# Altium schematic sheet 12_DDR2.SchDoc: DDR2
size A3; Organization: Lime Microsystems; Address1: Surrey Tech Centre; Address2: Guildford GU2 7YG; Address3: Surrey; Address4: United Kingdom; Revision: v1.3; SheetNumber: 12; SheetTotal: 16
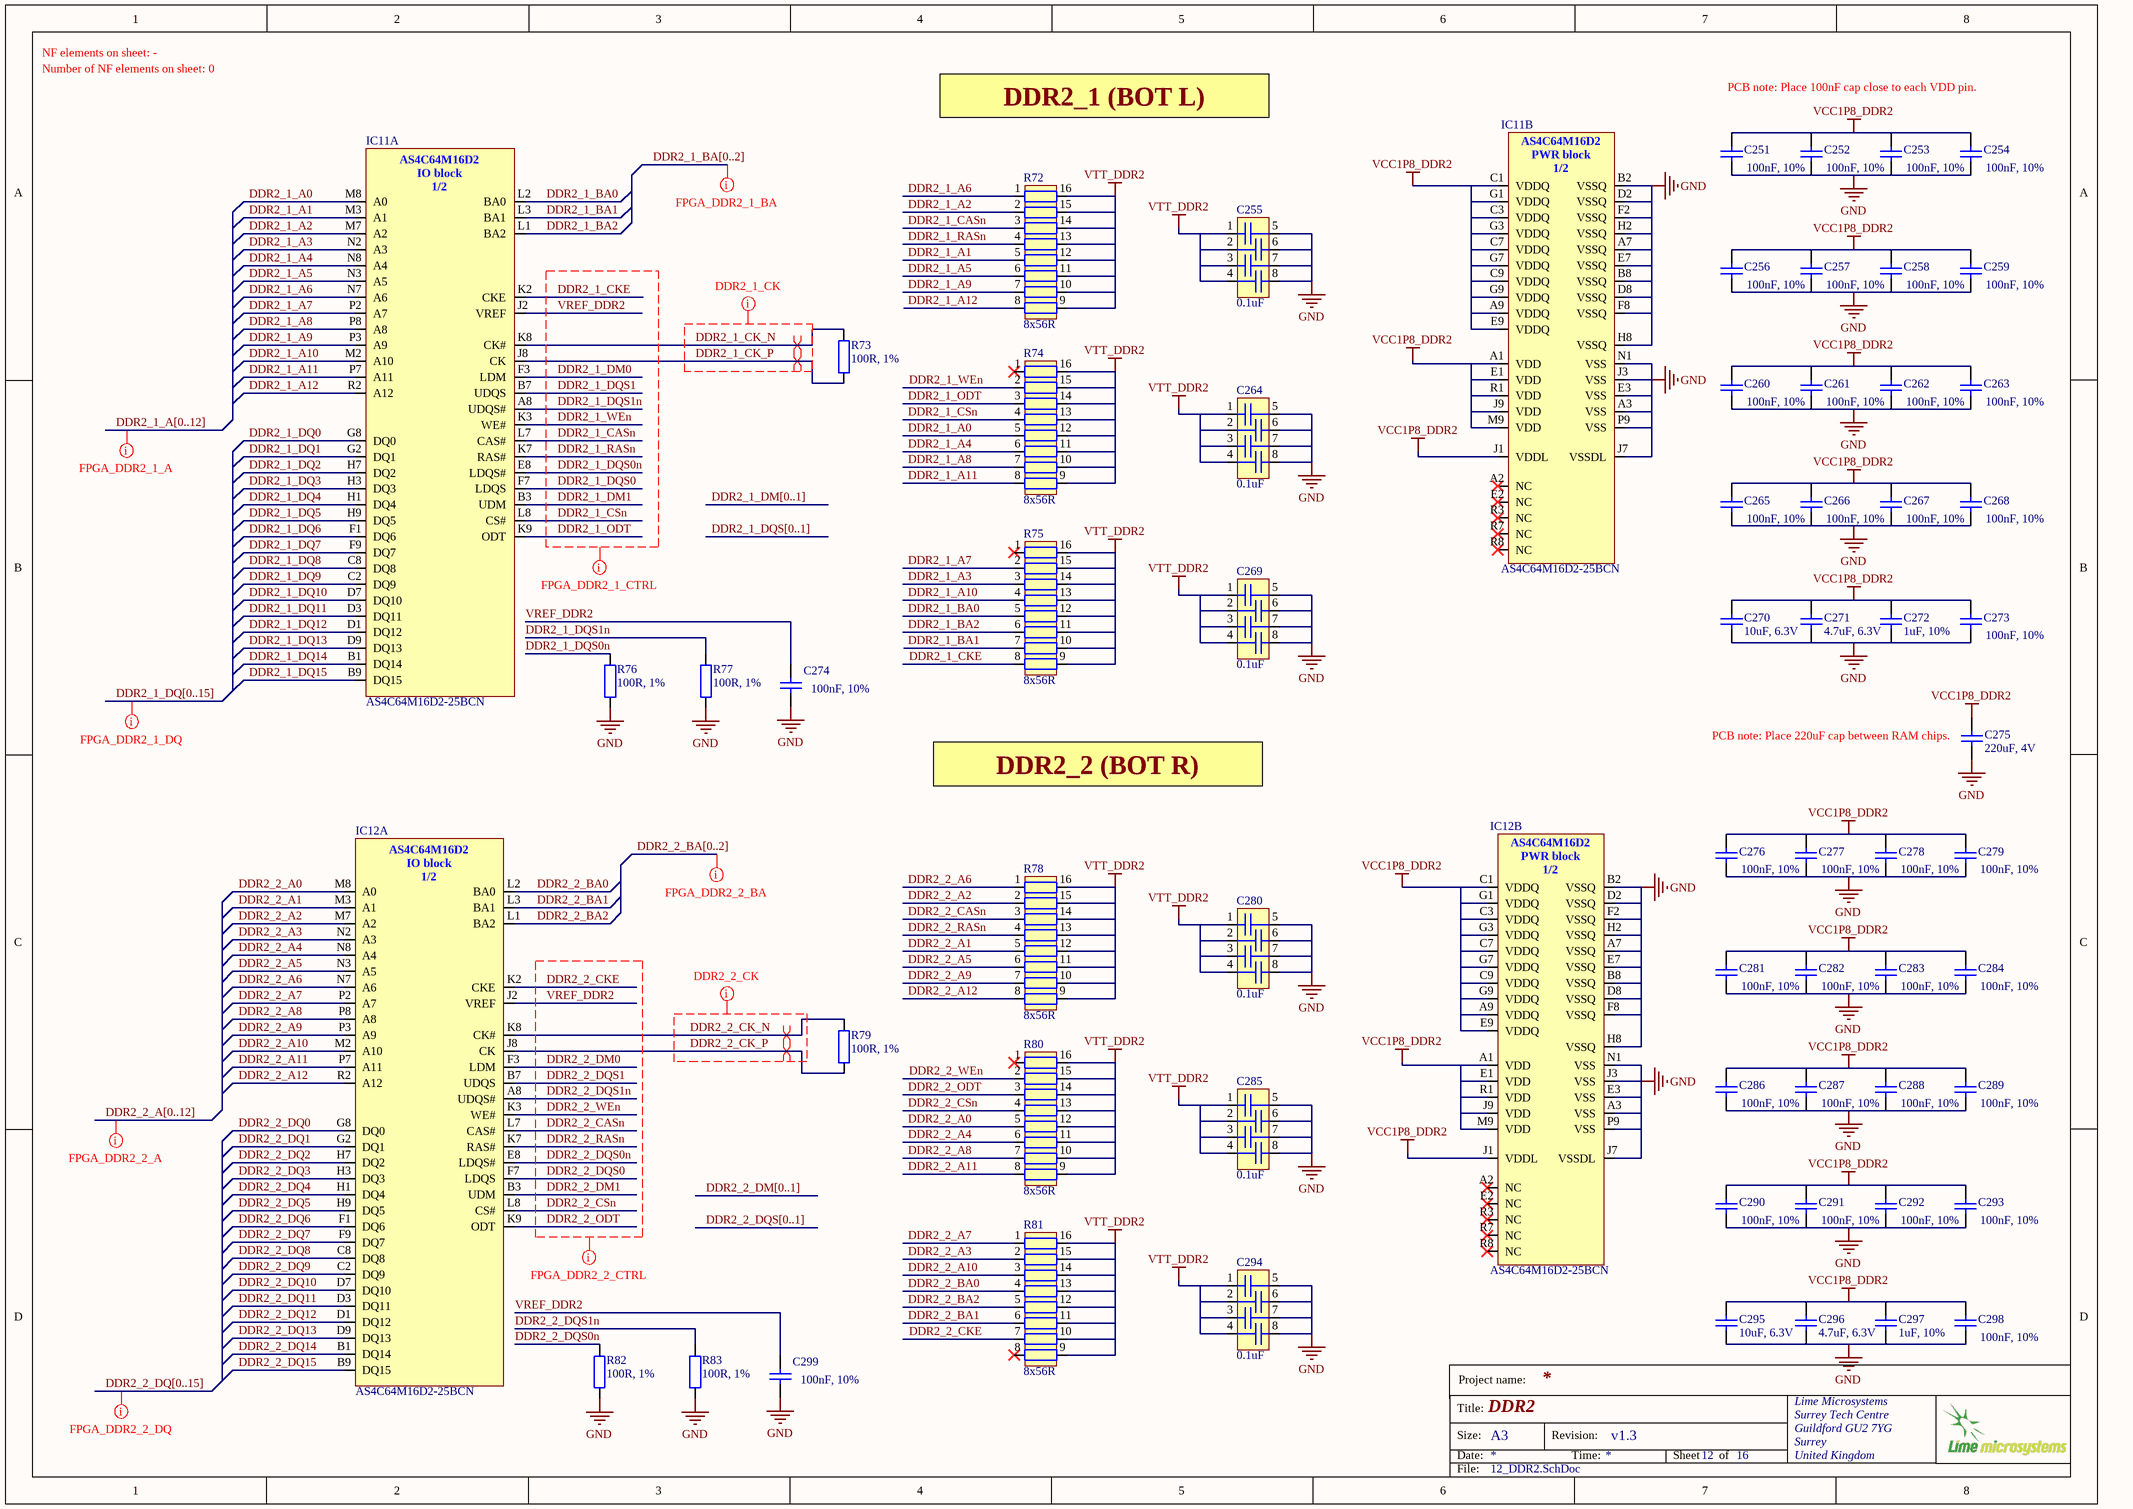
[diagram p0: 12_DDR2.SchDoc]

## Parts
C251  100nF, 10%  [CAP0402]
C252  100nF, 10%  [CAP0402]
C253  100nF, 10%  [CAP0402]
C254  100nF, 10%  [CAP0402]
C255  0.1uF  [CKCA43X7R1C104M100AA]
C256  100nF, 10%  [CAP0402]
C257  100nF, 10%  [CAP0402]
C258  100nF, 10%  [CAP0402]
C259  100nF, 10%  [CAP0402]
C260  100nF, 10%  [CAP0402]
C261  100nF, 10%  [CAP0402]
C262  100nF, 10%  [CAP0402]
C263  100nF, 10%  [CAP0402]
C264  0.1uF  [CKCA43X7R1C104M100AA]
C265  100nF, 10%  [CAP0402]
C266  100nF, 10%  [CAP0402]
C267  100nF, 10%  [CAP0402]
C268  100nF, 10%  [CAP0402]
C269  0.1uF  [CKCA43X7R1C104M100AA]
C270  10uF, 6.3V  [CAP0603]
C271  4.7uF, 6.3V  [CAP0402]
C272  1uF, 10%  [CAP0402]
C273  100nF, 10%  [CAP0402]
C274  100nF, 10%  [CAP0402]
C275  220uF, 4V  [CAP1206]
C276  100nF, 10%  [CAP0402]
C277  100nF, 10%  [CAP0402]
C278  100nF, 10%  [CAP0402]
C279  100nF, 10%  [CAP0402]
C280  0.1uF  [CKCA43X7R1C104M100AA]
C281  100nF, 10%  [CAP0402]
C282  100nF, 10%  [CAP0402]
C283  100nF, 10%  [CAP0402]
C284  100nF, 10%  [CAP0402]
C285  0.1uF  [CKCA43X7R1C104M100AA]
C286  100nF, 10%  [CAP0402]
C287  100nF, 10%  [CAP0402]
C288  100nF, 10%  [CAP0402]
C289  100nF, 10%  [CAP0402]
C290  100nF, 10%  [CAP0402]
C291  100nF, 10%  [CAP0402]
C292  100nF, 10%  [CAP0402]
C293  100nF, 10%  [CAP0402]
C294  0.1uF  [CKCA43X7R1C104M100AA]
C295  10uF, 6.3V  [CAP0603]
C296  4.7uF, 6.3V  [CAP0402]
C297  1uF, 10%  [CAP0402]
C298  100nF, 10%  [CAP0402]
C299  100nF, 10%  [CAP0402]
IC11  AS4C64M16D2-25BCN  [AS4C64M16D2]  (parts A,B of 2)
IC12  AS4C64M16D2-25BCN  [AS4C64M16D2]  (parts A,B of 2)
R72  8x56R  [EXB2HV]
R73  100R, 1%  [RES0402]
R74  8x56R  [EXB2HV]
R75  8x56R  [EXB2HV]
R76  100R, 1%  [RES0402]
R77  100R, 1%  [RES0402]
R78  8x56R  [EXB2HV]
R79  100R, 1%  [RES0402]
R80  8x56R  [EXB2HV]
R81  8x56R  [EXB2HV]
R82  100R, 1%  [RES0402]
R83  100R, 1%  [RES0402]

## Nets
GND: C251.2 C252.2 C253.2 C254.2 C255.5 C255.6 C255.7 C255.8 C256.2 C257.2 C258.2 C259.2 C260.2 C261.2 C262.2 C263.2 C264.5 C264.6 C264.7 C264.8 C265.2 C266.2 C267.2 C268.2 C269.5 C269.6 C269.7 C269.8 C270.1 C271.1 C272.1 C273.2 C274.2 C275.1 C276.2 C277.2 C278.2 C279.2 C280.5 C280.6 C280.7 C280.8 C281.2 C282.2 C283.2 C284.2 C285.5 C285.6 C285.7 C285.8 C286.2 C287.2 C288.2 C289.2 C290.2 C291.2 C292.2 C293.2 C294.5 C294.6 C294.7 C294.8 C295.1 C296.1 C297.1 C298.2 C299.2 IC11.A3(VSS) IC11.A7(VSSQ) IC11.B2(VSSQ) IC11.B8(VSSQ) IC11.D2(VSSQ) IC11.D8(VSSQ) IC11.E3(VSS) IC11.E7(VSSQ) IC11.F2(VSSQ) IC11.F8(VSSQ) IC11.H2(VSSQ) IC11.H8(VSSQ) IC11.J3(VSS) IC11.J7(VSSDL) IC11.N1(VSS) IC11.P9(VSS) IC12.A3(VSS) IC12.A7(VSSQ) IC12.B2(VSSQ) IC12.B8(VSSQ) IC12.D2(VSSQ) IC12.D8(VSSQ) IC12.E3(VSS) IC12.E7(VSSQ) IC12.F2(VSSQ) IC12.F8(VSSQ) IC12.H2(VSSQ) IC12.H8(VSSQ) IC12.J3(VSS) IC12.J7(VSSDL) IC12.N1(VSS) IC12.P9(VSS) R76.1 R77.1 R82.1 R83.1
VCC1P8_DDR2: C251.1 C252.1 C253.1 C254.1 C256.1 C257.1 C258.1 C259.1 C260.1 C261.1 C262.1 C263.1 C265.1 C266.1 C267.1 C268.1 C270.2 C271.2 C272.2 C273.1 C275.2 C276.1 C277.1 C278.1 C279.1 C281.1 C282.1 C283.1 C284.1 C286.1 C287.1 C288.1 C289.1 C290.1 C291.1 C292.1 C293.1 C295.2 C296.2 C297.2 C298.1 IC11.A1(VDD) IC11.A9(VDDQ) IC11.C1(VDDQ) IC11.C3(VDDQ) IC11.C7(VDDQ) IC11.C9(VDDQ) IC11.E1(VDD) IC11.E9(VDDQ) IC11.G1(VDDQ) IC11.G3(VDDQ) IC11.G7(VDDQ) IC11.G9(VDDQ) IC11.J1(VDDL) IC11.J9(VDD) IC11.M9(VDD) IC11.R1(VDD) IC12.A1(VDD) IC12.A9(VDDQ) IC12.C1(VDDQ) IC12.C3(VDDQ) IC12.C7(VDDQ) IC12.C9(VDDQ) IC12.E1(VDD) IC12.E9(VDDQ) IC12.G1(VDDQ) IC12.G3(VDDQ) IC12.G7(VDDQ) IC12.G9(VDDQ) IC12.J1(VDDL) IC12.J9(VDD) IC12.M9(VDD) IC12.R1(VDD)
VTT_DDR2: C255.1 C255.2 C255.3 C255.4 C264.1 C264.2 C264.3 C264.4 C269.1 C269.2 C269.3 C269.4 C280.1 C280.2 C280.3 C280.4 C285.1 C285.2 C285.3 C285.4 C294.1 C294.2 C294.3 C294.4 R72.9 R72.10 R72.11 R72.12 R72.13 R72.14 R72.15 R72.16 R74.9 R74.10 R74.11 R74.12 R74.13 R74.14 R74.15 R74.16 R75.9 R75.10 R75.11 R75.12 R75.13 R75.14 R75.15 R75.16 R78.9 R78.10 R78.11 R78.12 R78.13 R78.14 R78.15 R78.16 R80.9 R80.10 R80.11 R80.12 R80.13 R80.14 R80.15 R80.16 R81.9 R81.10 R81.11 R81.12 R81.13 R81.14 R81.15 R81.16
DDR2_1_A0: IC11.M8(A0) R74.5
DDR2_1_A1: IC11.M3(A1) R72.5
DDR2_1_A2: IC11.M7(A2) R72.2
DDR2_1_A3: IC11.N2(A3) R75.3
DDR2_1_A4: IC11.N8(A4) R74.6
DDR2_1_A5: IC11.N3(A5) R72.6
DDR2_1_A6: IC11.N7(A6) R72.1
DDR2_1_A7: IC11.P2(A7) R75.2
DDR2_1_A8: IC11.P8(A8) R74.7
DDR2_1_A9: IC11.P3(A9) R72.7
DDR2_1_A10: IC11.M2(A10) R75.4
DDR2_1_A11: IC11.P7(A11) R74.8
DDR2_1_A12: IC11.R2(A12) R72.8
DDR2_1_BA0: IC11.L2(BA0) R75.5
DDR2_1_BA1: IC11.L3(BA1) R75.7
DDR2_1_BA2: IC11.L1(BA2) R75.6
DDR2_1_CASn: IC11.L7(CAS#) R72.3
DDR2_1_CK_N: IC11.K8(CK#) R73.2
DDR2_1_CK_P: IC11.J8(CK) R73.1
DDR2_1_CKE: IC11.K2(CKE) R75.8
DDR2_1_CSn: IC11.L8(CS#) R74.4
DDR2_1_DM0: IC11.F3(LDM)
DDR2_1_DM1: IC11.B3(UDM)
DDR2_1_DQ0: IC11.G8(DQ0)
DDR2_1_DQ1: IC11.G2(DQ1)
DDR2_1_DQ2: IC11.H7(DQ2)
DDR2_1_DQ3: IC11.H3(DQ3)
DDR2_1_DQ4: IC11.H1(DQ4)
DDR2_1_DQ5: IC11.H9(DQ5)
DDR2_1_DQ6: IC11.F1(DQ6)
DDR2_1_DQ7: IC11.F9(DQ7)
DDR2_1_DQ8: IC11.C8(DQ8)
DDR2_1_DQ9: IC11.C2(DQ9)
DDR2_1_DQ10: IC11.D7(DQ10)
DDR2_1_DQ11: IC11.D3(DQ11)
DDR2_1_DQ12: IC11.D1(DQ12)
DDR2_1_DQ13: IC11.D9(DQ13)
DDR2_1_DQ14: IC11.B1(DQ14)
DDR2_1_DQ15: IC11.B9(DQ15)
DDR2_1_DQS0: IC11.F7(LDQS)
DDR2_1_DQS0n: IC11.E8(LDQS#) R76.2
DDR2_1_DQS1: IC11.B7(UDQS)
DDR2_1_DQS1n: IC11.A8(UDQS#) R77.2
DDR2_1_ODT: IC11.K9(ODT) R74.3
DDR2_1_RASn: IC11.K7(RAS#) R72.4
DDR2_1_WEn: IC11.K3(WE#) R74.2
DDR2_2_A0: IC12.M8(A0) R80.5
DDR2_2_A1: IC12.M3(A1) R78.5
DDR2_2_A2: IC12.M7(A2) R78.2
DDR2_2_A3: IC12.N2(A3) R81.2
DDR2_2_A4: IC12.N8(A4) R80.6
DDR2_2_A5: IC12.N3(A5) R78.6
DDR2_2_A6: IC12.N7(A6) R78.1
DDR2_2_A7: IC12.P2(A7) R81.1
DDR2_2_A8: IC12.P8(A8) R80.7
DDR2_2_A9: IC12.P3(A9) R78.7
DDR2_2_A10: IC12.M2(A10) R81.3
DDR2_2_A11: IC12.P7(A11) R80.8
DDR2_2_A12: IC12.R2(A12) R78.8
DDR2_2_BA0: IC12.L2(BA0) R81.4
DDR2_2_BA1: IC12.L3(BA1) R81.6
DDR2_2_BA2: IC12.L1(BA2) R81.5
DDR2_2_CASn: IC12.L7(CAS#) R78.3
DDR2_2_CK_N: IC12.K8(CK#) R79.2
DDR2_2_CK_P: IC12.J8(CK) R79.1
DDR2_2_CKE: IC12.K2(CKE) R81.7
DDR2_2_CSn: IC12.L8(CS#) R80.4
DDR2_2_DM0: IC12.F3(LDM)
DDR2_2_DM1: IC12.B3(UDM)
DDR2_2_DQ0: IC12.G8(DQ0)
DDR2_2_DQ1: IC12.G2(DQ1)
DDR2_2_DQ2: IC12.H7(DQ2)
DDR2_2_DQ3: IC12.H3(DQ3)
DDR2_2_DQ4: IC12.H1(DQ4)
DDR2_2_DQ5: IC12.H9(DQ5)
DDR2_2_DQ6: IC12.F1(DQ6)
DDR2_2_DQ7: IC12.F9(DQ7)
DDR2_2_DQ8: IC12.C8(DQ8)
DDR2_2_DQ9: IC12.C2(DQ9)
DDR2_2_DQ10: IC12.D7(DQ10)
DDR2_2_DQ11: IC12.D3(DQ11)
DDR2_2_DQ12: IC12.D1(DQ12)
DDR2_2_DQ13: IC12.D9(DQ13)
DDR2_2_DQ14: IC12.B1(DQ14)
DDR2_2_DQ15: IC12.B9(DQ15)
DDR2_2_DQS0: IC12.F7(LDQS)
DDR2_2_DQS0n: IC12.E8(LDQS#) R82.2
DDR2_2_DQS1: IC12.B7(UDQS)
DDR2_2_DQS1n: IC12.A8(UDQS#) R83.2
DDR2_2_ODT: IC12.K9(ODT) R80.3
DDR2_2_RASn: IC12.K7(RAS#) R78.4
DDR2_2_WEn: IC12.K3(WE#) R80.2
VREF_DDR2: C274.1 C299.1 IC11.J2(VREF) IC12.J2(VREF)

Not connected (* = marked no-connect by the designer): IC11 A2(NC)* E2(NC)* R3(NC)* R7(NC)* R8(NC)*; IC12 A2(NC)* E2(NC)* R3(NC)* R7(NC)* R8(NC)*; R74 1*; R75 1*; R80 1*; R81 8*

## Buses and harness runs
bus DDR2_1_A[0..12]
bus DDR2_1_BA[0..2]
bus DDR2_1_DM[0..1]
bus DDR2_1_DQ[0..15]
bus DDR2_1_DQS[0..1]
bus DDR2_2_A[0..12]
bus DDR2_2_BA[0..2]
bus DDR2_2_DM[0..1]
bus DDR2_2_DQ[0..15]
bus DDR2_2_DQS[0..1]

## Layout directives
net class FPGA_DDR0_DQ: (no net found under the mark)
net class FPGA_DDR0_BA: (no net found under the mark)
net class FPGA_DDR0_CTRL: DDR2_1_CASn, DDR2_1_CKE, DDR2_1_CSn, DDR2_1_DM0, DDR2_1_DM1, DDR2_1_DQS0, DDR2_1_DQS0n, DDR2_1_DQS1, DDR2_1_DQS1n, DDR2_1_ODT, DDR2_1_RASn, DDR2_1_WEn, VREF_DDR2
net class FPGA_DDR0_A: (no net found under the mark)
net class FPGA_DDR1_DQ: (no net found under the mark)
net class FPGA_DDR1_BA: (no net found under the mark)
net class FPGA_DDR1_CTRL: DDR2_2_CASn, DDR2_2_CKE, DDR2_2_CSn, DDR2_2_DM0, DDR2_2_DM1, DDR2_2_DQS0, DDR2_2_DQS0n, DDR2_2_DQS1, DDR2_2_DQS1n, DDR2_2_ODT, DDR2_2_RASn, DDR2_2_WEn, VREF_DDR2
net class FPGA_DDR1_A: (no net found under the mark)
differential pair: DDR2_1_CK_N, DDR2_1_CK_P, DDR2_2_CK_N, DDR2_2_CK_P
net class DDR2_2_CK: DDR2_2_CK_N, DDR2_2_CK_P
net class DDR2_1_CK: DDR2_1_CK_N, DDR2_1_CK_P

## Notes on the sheet
- Number of NF elements on sheet: 0
- NF elements on sheet: -
- DDR2_1 (BOT L)
- PCB note: Place 100nF cap close to each VDD pin.
- DDR2_2 (BOT R)
- (near C275) PCB note: Place 220uF cap between RAM chips.
- Project name:
- Title:
- Size:
- Date:
- A3
- Revision:
- Time:
- Sheet
- of
- File:
- (in symbol AS4C64M16D2-25BCN, part A) AS4C64M16D2 / IO block / 1/2
- (in symbol AS4C64M16D2-25BCN, part B) AS4C64M16D2 / PWR block / 1/2

## Library data of the parts
C251-C254 C256-C263 C265-C268 C273 C274 C276-C279 C281-C284 C286-C293 C298 C299 = Cap_0603: Manufacturer Part Number 1: GRM155R71C104KA88D; Part Description: 0.10µF ±10% 16V X7R Ceramic Capacitor -55°C ~ 125°C Surface Mount, MLCC 0402 (1005 Metric) 0.039" L x 0.020" W (1.00mm x 0.50mm); Brand: Murata Electronics; Type: General Purpose MLCC; Capacitance: 0.1 uF; Temperature Coefficient / Code: +/- 15 %; Voltage Rating DC: 16 V; Supplier 1: Mouser; Supplier Part Number 1: 81-GRM155R71C104KA88; Tolerance: 10 %; Case Code - in: 0402; Manufacturer: Murata Electronics; Category: Multilayer Ceramic Capacitors MLCC - SMD/SMT; Value: 100nF, 10%; Manufacturer Part Number: GRM155R71C104KA88D; Maximum Operating Temperature: + 125 C; Minimum Operating Temperature: - 55 C; Minimum Order Quantity: 1; Operating Temperature Range: - 55 C to + 125 C; Package / Case: 0402 (1005 metric); Packaging: Reel; Product: General Type MLCCs; Product Category: Low & Medium Capacitance SMD Ceramic Chip Capacitors; Reeling: True; RoHS - Mouser: Y; RoHS: RoHS Compliant; Series: GRM; Standard Pack Qty: 10000; Termination Style: SMD/SMT
C255 C264 C269 C280 C285 C294 = 4X_cap_array_1206: Manufacturer: TDK; Part Description: CAP ARRAY 0.1UF 16V X7R 1206; Case Height: 1 mm; Case Length: 3.2 mm; Case Width: 1.6 mm; Voltage Rating: 16 V; Number of Elements: 4; Tolerance: 20 %; Temperature Coefficient / Code: X7R; Value: 0.1uF; Supplier 1: Mouser; Supplier Part Number 1: 810-CKCA43X7R1C104M; RoHS: RoHS Compliant; Termination Style: SMD/SMT; Brand: TDK; Category: Capacitor Arrays & Networks; Product: Ceramic Capacitor Arrays; Series: CKC; Packaging: Reel; Operating Temperature Range: - 55 C to + 125 C; Manufacturer Part Number 1: CKCA43X7R1C104M100AA; Capacitance: 0.1 uF; Product Category: Capacitor Arrays; Standard Pack Qty: 2000; RoHS - Mouser: Y; Minimum Order Quantity: 1; Reeling: True
C270 C295 = Cap_0603: Manufacturer Part Number 1: CC0603MRX5R5BB106; Part Description: 10µF ±20% 6.3V X5R Ceramic Capacitor -55°C ~ 85°C Surface Mount, MLCC 0603 (1608 Metric) 0.063" L x 0.031" W (1.60mm x 0.80mm); Manufacturer: Yageo; Capacitance: 10µF; Tolerance: ±20%; Supplier 1: Digi-Key; Supplier Part Number 1: 311-1448-2-ND; Package / Case: 0603 (1608 Metric); Category: Capacitors; Voltage - Rated: 6.3V; Value: 10uF, 6.3V
C271 C296 = Cap_0402: Manufacturer Part Number 1: GRM155R60J475ME87D; Manufacturer: Murata Electronics North America; Part Description: 4.7µF ±20% 6.3V X5R Ceramic Capacitor -55°C ~ 85°C Surface Mount, MLCC 0402 (1005 Metric) 0.039" L x 0.020" W (1.00mm x 0.50mm); Temperature Coefficient: X5R; Capacitance: 4.7µF; Tolerance: ±20%; Value: 4.7uF, 6.3V; Supplier 1: Digi-Key; Supplier Part Number 1: 490-5408-1-ND; Category: Capacitors; Voltage - Rated: 6.3V; Thickness (Max): 0.022" (0.55mm); Applications: General Purpose; Package / Case: 0402 (1005 Metric); Size / Dimension: 0.039" L x 0.020" W (1.00mm x 0.50mm); Features: Derating Recommended; Mounting Type: Surface Mount, MLCC; Ratings: -; Lead Style: -; Operating Temperature: -55°C ~ 85°C; Lead Spacing: -; RoHS: RoHS Compliant; Height - Seated (Max): -; Packaging: Cut Tape (CT)
C272 C297 = Cap_0402: Manufacturer Part Number 1: GRM155R61A105KE15J; Manufacturer: TDK; Part Description: 1µF ±10% 10V X5R Ceramic Capacitor -55°C ~ 85°C Surface Mount, MLCC 0402 (1005 Metric) 0.039" L x 0.020" W (1.00mm x 0.50mm); Voltage Rating: 10; Product Range: TDK - C Series; Ceramic Capacitor Case: 0402 [1005 Metric]; Capacitance: 1; Dielectric Characteristic: X6; Value: 1uF, 10%; Supplier 1: Newark; Supplier Part Number 1: 490-6298-2-ND; Capacitance Tolerance: ± 10%; MSL: -; RoHS: YES
C275 = Cap_1206: Manufacturer Part Number: GRM31CR60G227ME11L; Manufacturer: Murata Electronics North America; Part Description: 220µF ±20% 4V X5R Ceramic Capacitor -55°C ~ 85°C Surface Mount, MLCC 1206 (3216 Metric) 0.126" L x 0.063" W (3.20mm x 1.60mm); Capacitance: 220µF; Temperature Coefficient: X5R; Tolerance: ±20%; Package / Case: 1206 (3216 Metric); Supplier 1: Digi-Key; Packaging: Cut Tape (CT); Size / Dimension: 0.126" L x 0.063" W (3.20mm x 1.60mm); Operating Temperature: -55°C ~ 85°C; Voltage - Rated: 4V; Mounting Type: Surface Mount, MLCC; Ratings: -; Supplier Part Number 1: 490-9774-1-ND; Category: Capacitors; Lead Spacing: -; Lead Style: -; Applications: General Purpose; Features: -; Height - Seated (Max): -; Thickness (Max): 0.075" (1.90mm); RoHS: RoHS Compliant; Value: 220uF, 4V
IC11 IC12 = AS4C64M16D2-25BCN: Manufacturer: Alliance Memory, Inc.; Part Description: IC SDRAM 64MX16 1.8V 84-FBGA; Speed: 400MHz; Interface: Parallel; Memory Type: DDR2 SDRAM; Memory Size: 1G (64M x 16); Voltage - Supply: 1.7 V ~ 1.9 V; Format - Memory: RAM; Supplier 1: Digi-Key; Package / Case: 84-TFBGA; Supplier Device Package: 84-FBGA (8x12.5); Manufacturer Part Number 1: AS4C64M16D2-25BCN; RoHS: RoHS Compliant; Operating Temperature: 0°C ~ 70°C; Category: Integrated Circuits (ICs); Packaging: Tray; Supplier Part Number 1: 1450-1158-ND
R72 R74 R75 R78 R80 R81 = 8X_resistor_array_0402: Manufacturer Part Number 1: EXB2HV560JV; Manufacturer: PANASONIC ELECTRONIC COMPONENTS; Part Description: RESISTOR,CVEX ARRAY,0402X8, 56R 5%; Supplier 1: Farnell; Supplier Part Number 1: 2060070; RoHS: YES
R73 R76 R77 R79 R82 R83 = Res_0402: Manufacturer Part Number 1: RMCF0402FT100R; Part Description: RES SMD 100 OHM 1% 1/16W 0402; Manufacturer: Stackpole Electronics Inc.; Temperature Coefficient: ±100ppm/°C; Supplier 1: Digi-Key; Supplier Part Number 1: RMCF0402FT100RDKR-ND; Package / Case: 0402 (1005 Metric); Composition: Thick Film; Category: Resistors; Tolerance: ±1%; Value: 100R, 1%